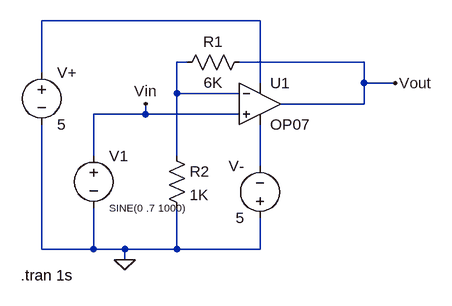
[diagram p0: schematic OpAmp3.asc]
OpAmp3.asc, the LTspice schematic file:
Version 4
SHEET 1 880 680
WIRE 320 -16 -16 -16
WIRE 208 48 192 48
WIRE 480 48 288 48
WIRE -16 64 -16 -16
WIRE 320 80 320 -16
WIRE 480 80 480 48
WIRE 528 80 480 80
WIRE 192 96 192 48
WIRE 288 96 192 96
WIRE 480 112 480 80
WIRE 480 112 352 112
WIRE 144 128 144 112
WIRE 144 128 64 128
WIRE 288 128 144 128
WIRE 64 192 64 128
WIRE 192 192 192 96
WIRE 320 208 320 144
WIRE -16 336 -16 144
WIRE 64 336 64 272
WIRE 64 336 -16 336
WIRE 112 336 64 336
WIRE 192 336 192 272
WIRE 192 336 112 336
WIRE 320 336 320 288
WIRE 320 336 192 336
WIRE 112 352 112 336
FLAG 528 80 Vout
FLAG 144 112 Vin
FLAG 112 352 0
SYMBOL voltage -16 48 R0
WINDOW 123 0 0 Left 0
WINDOW 39 0 0 Left 0
SYMATTR InstName V+
SYMATTR Value 5
SYMBOL voltage 320 304 R180
WINDOW 0 24 96 Left 2
WINDOW 3 24 16 Left 2
WINDOW 123 0 0 Left 0
WINDOW 39 0 0 Left 0
SYMATTR InstName V-
SYMATTR Value 5
SYMBOL voltage 64 176 R0
WINDOW 3 24 96 Left 1
WINDOW 123 0 0 Left 0
WINDOW 39 0 0 Left 0
SYMATTR Value SINE(0 .7 1000)
SYMATTR InstName V1
SYMBOL res 176 176 R0
SYMATTR InstName R2
SYMATTR Value 1K
SYMBOL res 304 32 R90
WINDOW 0 0 56 VBottom 2
WINDOW 3 32 56 VTop 2
SYMATTR InstName R1
SYMATTR Value 6K
SYMBOL OpAmps\\OP07 320 48 R0
SYMATTR InstName U1
TEXT -48 376 Left 2 !.tran 1s

The netlist it stands for:
* OpAmp3.asc
V+ N001 0 5
V- 0 N003 5
V1 Vin 0 SINE(0 .7 1000)
R2 N002 0 1K
R1 Vout N002 6K
XU1 Vin N002 N001 N003 Vout LT1001  ; OP07, pins In+ In- V+ V- OUT
.tran 1s
.lib LTC.lib
.backanno
.end